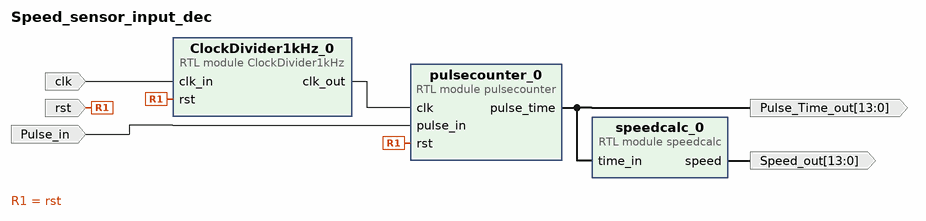
[diagram p0: block diagram of the top level]
# Vivado block design Speed_sensor_input_dec, xc7z020clg400-1, Vivado 2023.1
create_bd_design Speed_sensor_input_dec

create_bd_port -dir I Pulse_in
create_bd_port -dir I clk
create_bd_port -dir I rst
create_bd_port -dir O -from 13 -to 0 Pulse_Time_out
create_bd_port -dir O -from 13 -to 0 Speed_out

create_bd_cell -type module -reference ClockDivider1kHz ClockDivider1kHz_0
create_bd_cell -type module -reference pulsecounter pulsecounter_0
create_bd_cell -type module -reference speedcalc speedcalc_0

# ---- connections ----

connect_bd_net [get_bd_pins ClockDivider1kHz_0/clk_out] [get_bd_pins pulsecounter_0/clk]
connect_bd_net [get_bd_ports Pulse_in] [get_bd_pins pulsecounter_0/pulse_in]
connect_bd_net [get_bd_ports clk] [get_bd_pins ClockDivider1kHz_0/clk_in]
connect_bd_net [get_bd_pins pulsecounter_0/pulse_time] [get_bd_pins speedcalc_0/time_in] [get_bd_ports Pulse_Time_out]
connect_bd_net [get_bd_ports rst] [get_bd_pins ClockDivider1kHz_0/rst] [get_bd_pins pulsecounter_0/rst]
connect_bd_net [get_bd_pins speedcalc_0/speed] [get_bd_ports Speed_out]

validate_bd_design
save_bd_design
